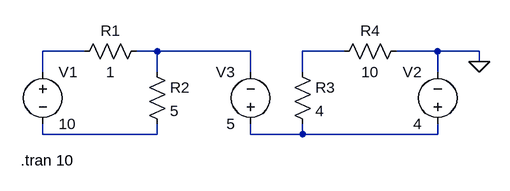
[diagram p0: schematic Bridge voltage.asc]
Bridge voltage.asc, the LTspice schematic file:
Version 4
SHEET 1 880 680
WIRE 112 96 48 96
WIRE 224 96 192 96
WIRE 368 96 224 96
WIRE 512 96 448 96
WIRE 656 96 592 96
WIRE 720 96 656 96
WIRE 720 112 720 96
WIRE 48 128 48 96
WIRE 224 128 224 96
WIRE 368 128 368 96
WIRE 448 128 448 96
WIRE 656 128 656 96
WIRE 48 224 48 208
WIRE 224 224 224 208
WIRE 224 224 48 224
WIRE 368 224 368 208
WIRE 448 224 448 208
WIRE 448 224 368 224
WIRE 656 224 656 208
WIRE 656 224 448 224
FLAG 720 112 0
SYMBOL voltage 48 112 R0
WINDOW 123 0 0 Left 0
WINDOW 39 0 0 Left 0
SYMATTR InstName V1
SYMATTR Value 10
SYMBOL voltage 656 224 R180
WINDOW 0 24 96 Left 2
WINDOW 3 24 16 Left 2
WINDOW 123 0 0 Left 0
WINDOW 39 0 0 Left 0
SYMATTR InstName V2
SYMATTR Value 4
SYMBOL voltage 368 224 R180
WINDOW 0 24 96 Left 2
WINDOW 3 24 16 Left 2
WINDOW 123 0 0 Left 0
WINDOW 39 0 0 Left 0
SYMATTR InstName V3
SYMATTR Value 5
SYMBOL res 208 80 R90
WINDOW 0 0 56 VBottom 2
WINDOW 3 32 56 VTop 2
SYMATTR InstName R1
SYMATTR Value 1
SYMBOL res 208 112 R0
SYMATTR InstName R2
SYMATTR Value 5
SYMBOL res 432 112 R0
SYMATTR InstName R3
SYMATTR Value 4
SYMBOL res 608 80 R90
WINDOW 0 0 56 VBottom 2
WINDOW 3 32 56 VTop 2
SYMATTR InstName R4
SYMATTR Value 10
TEXT 14 264 Left 2 !.tran 10

The netlist it stands for:
* Bridge voltage.asc
V1 N001 N004 10
V2 N005 0 4
V3 N005 N002 5
R1 N002 N001 1
R2 N002 N004 5
R3 N003 N005 4
R4 0 N003 10
.tran 10
.backanno
.end